# EAGLE design 009 (EAGLE 5.09)
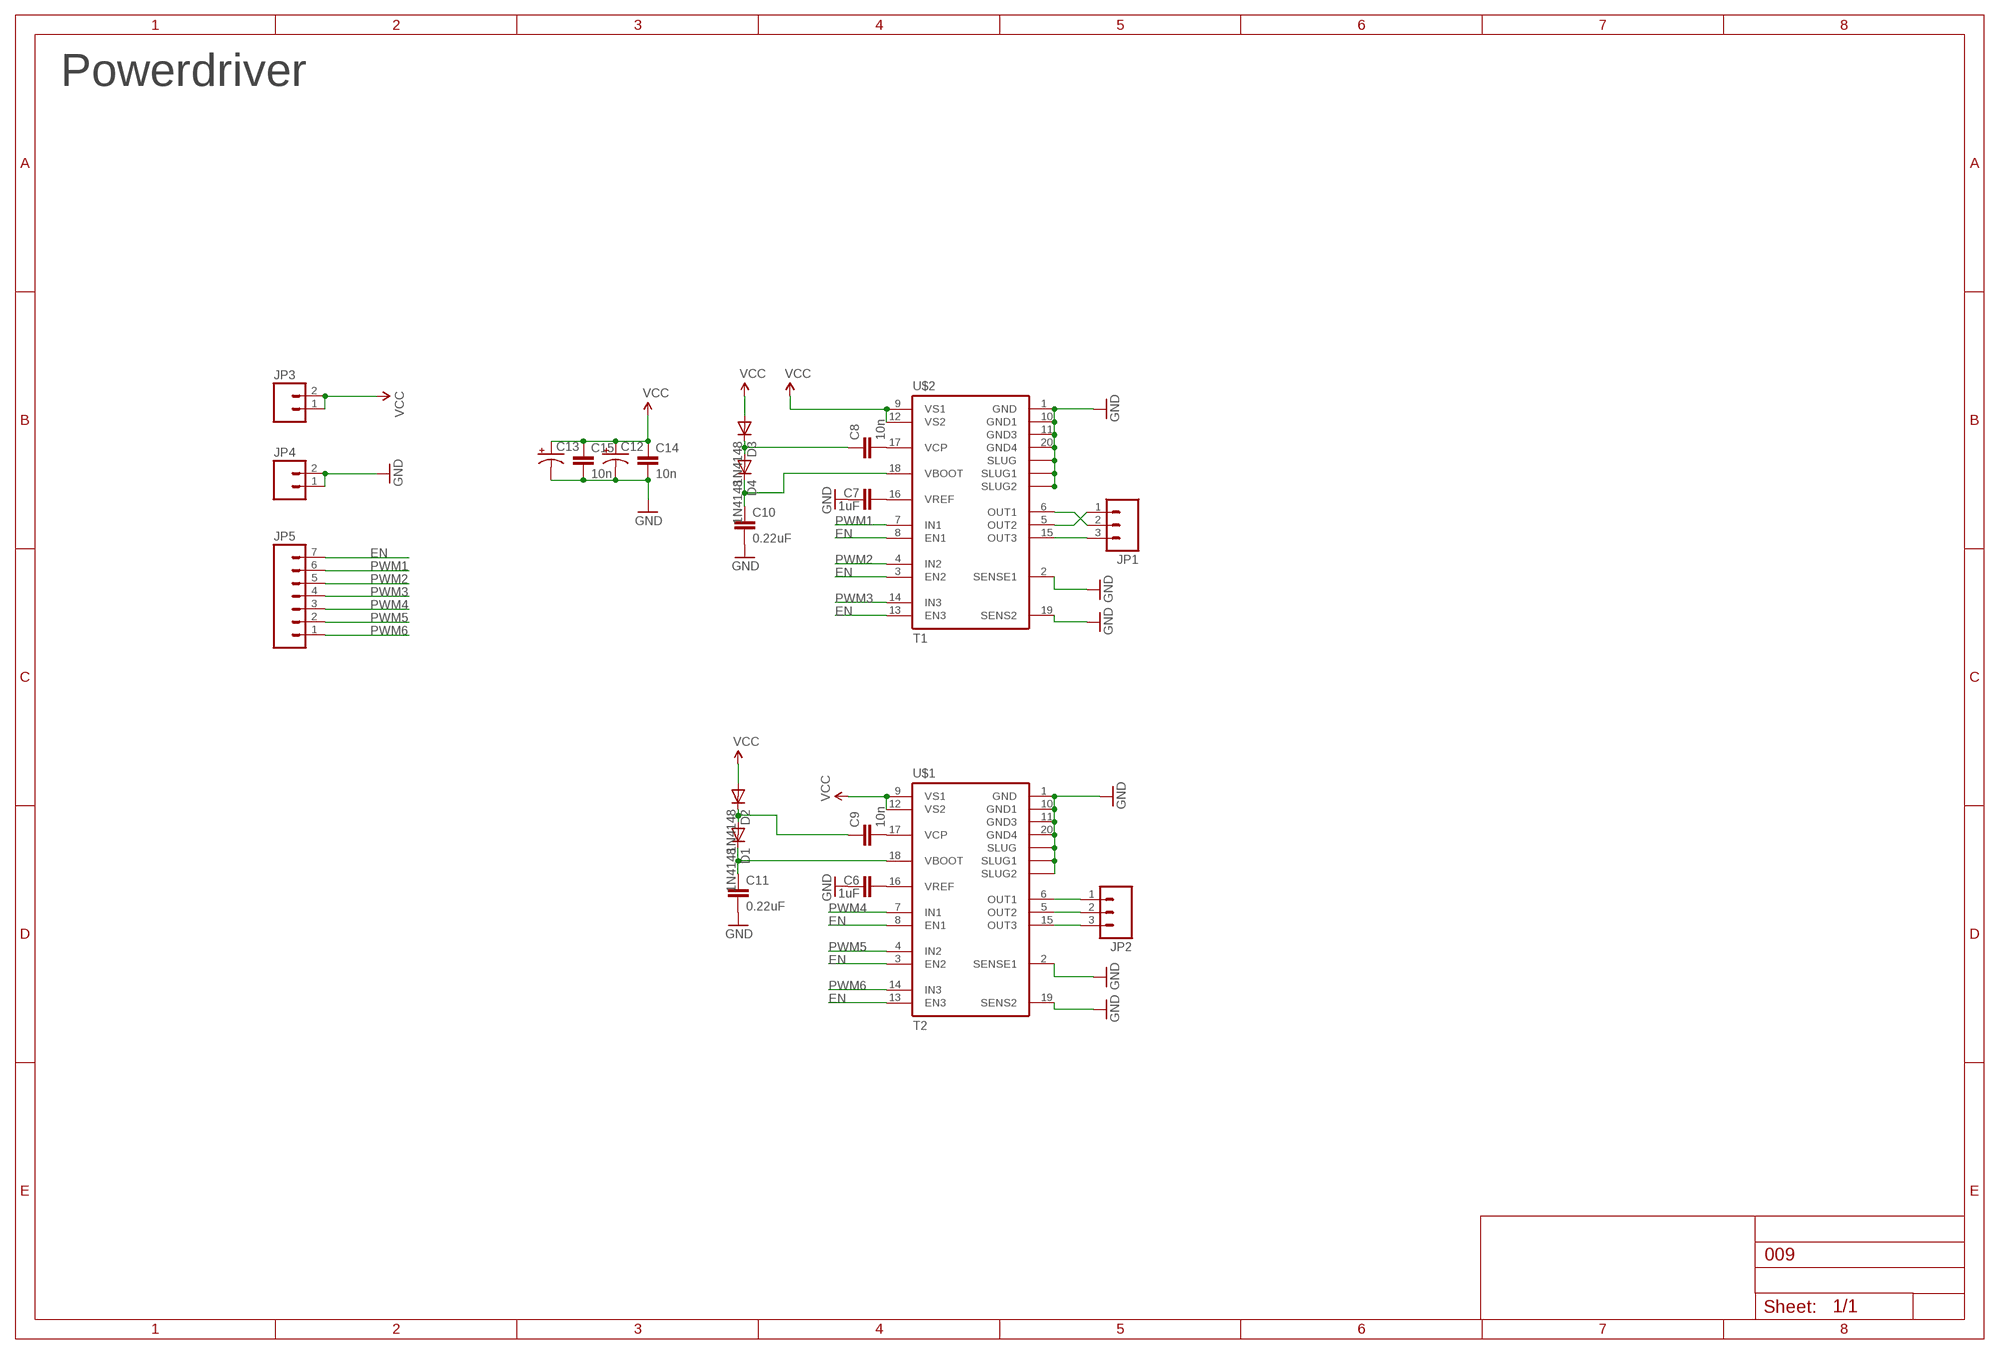
[diagram p0: schematic, sheet 1]

## Parts
C6  1uF  CAP0805  [0805]
C7  1uF  CAP0805  [0805]
C8  10n  CAP0805  [0805]
C9  10n  CAP0805  [0805]
C10  0.22uF  CAP0805  [0805]
C11  0.22uF  CAP0805  [0805]
C12  CAP_POLPTH1  [CPOL-RADIAL-100UF-25V]
C13  CAP_POLPTH1  [CPOL-RADIAL-100UF-25V]
C14  10n  CAP0805  [0805]
C15  10n  CAP0805  [0805]
D1  1N4148  DIODE-MINIMELF  [MINIMELF]
D2  1N4148  DIODE-MINIMELF  [MINIMELF]
D3  1N4148  DIODE-MINIMELF  [MINIMELF]
D4  1N4148  DIODE-MINIMELF  [MINIMELF]
JP1  M03PTH  [1X03]
JP2  M03PTH  [1X03]
JP3  M02PTH  [1X02]
JP4  M02PTH  [1X02]
JP5  M07  [1X07]
U$1  T2  L6234  [SO20POWER2]
U$2  T1  L6234  [SO20POWER2]

## Nets
EN: JP5.7 U$1.3(EN2) U$1.8(EN1) U$1.13(EN3) U$2.3(EN2) U$2.8(EN1) U$2.13(EN3)
GND: C6.1 C7.1 C10.2 C11.2 C12.2(-) C13.2(-) C14.2 C15.2 JP4.1 JP4.2 U$1.1(GND) U$1.2(SENSE1) U$1.10(GND1) U$1.11(GND3) U$1.19(SENS2) U$1.20(GND4) U$1.SLUG1(SLUG2) U$1.SLUG2(SLUG) U$1.SLUG(SLUG1) U$2.1(GND) U$2.2(SENSE1) U$2.10(GND1) U$2.11(GND3) U$2.19(SENS2) U$2.20(GND4) U$2.SLUG1(SLUG2) U$2.SLUG2(SLUG) U$2.SLUG(SLUG1)
N$1: JP1.1 U$2.5(OUT2)
N$2: JP1.2 U$2.6(OUT1)
N$3: JP1.3 U$2.15(OUT3)
N$4: JP2.1 U$1.6(OUT1)
N$5: JP2.2 U$1.5(OUT2)
N$6: JP2.3 U$1.15(OUT3)
N$9: C6.2 U$1.16(VREF)
N$10: C7.2 U$2.16(VREF)
N$11: C8.2 U$2.17(VCP)
N$12: C9.2 U$1.17(VCP)
N$13: C9.1 D1.A D2.C
N$16: C11.1 D1.C U$1.18(VBOOT)
PWM1: JP5.6 U$2.7(IN1)
PWM2: JP5.5 U$2.4(IN2)
PWM3: JP5.4 U$2.14(IN3)
PWM4: JP5.3 U$1.7(IN1)
PWM5: JP5.2 U$1.4(IN2)
PWM6: JP5.1 U$1.14(IN3)
VBOOT: C10.1 D4.C U$2.18(VBOOT)
VCC: C12.1(+) C13.1(+) C14.1 C15.1 D2.A D3.A JP3.1 JP3.2 U$1.9(VS1) U$1.12(VS2) U$2.9(VS1) U$2.12(VS2)
VCP: C8.1 D3.C D4.A

## Notes on the sheet
- FTDI
- Powerdriver

## Library data of the parts
C6-C11 C14 C15 = SparkFun:CAP: Capacitor Standard 0603 ceramic capacitor, and 0.1" leaded capacitor.
C12 C13 = SparkFun:CAP_POL: Capacitor Polarized These are standard SMD and PTH capacitors. Normally 10uF, 47uF, and 100uF in electrolytic and tantalum varieties. Always verify the external diameter of the through hole cap, it varies with capacity, voltage, and manufacturer. The EIA devices should be standard.
D1-D4 = diode:DIODE-: DIODE
JP1 JP2 = SparkFun:M03: Header 3 Standard 3-pin 0.1" header. Use with straight break away headers (SKU : PRT-00116), right angle break away headers (PRT-00553), swiss pins (PRT-00743), machine pins (PRT-00117), and female headers (PRT-00115). Molex polarized connector foot print use with SKU : PRT-08232 with associated crimp pins and housings.
JP3 JP4 = SparkFun:M02: Header 2 Standard 2-pin 0.1" header. Use with straight break away headers (SKU : PRT-00116), right angle break away headers (PRT-00553), swiss pins (PRT-00743), machine pins (PRT-00117), and female headers (PRT-00115). Molex polarized connector foot print use with SKU : PRT-08233 with associated crimp pins and housings.
JP5 = SparkFun:M07: Header 7 Standard 7-pin 0.1" header. Use with straight break away headers (SKU : PRT-00116), right angle break away headers (PRT-00553), swiss pins (PRT-00743), machine pins (PRT-00117), and female headers (PRT-00115). NOTES ON THE VARIANTS LOCK and LOCK_LONGPADS... This footprint was designed to help hold the alignment of a through-hole component (i.e. 7-pin header) while soldering it into place. You may notice that each hole has been shifted either up or down by 0.005 of an inch from it's more standard position (which is usually a perfectly straight line). This slight alteration caused the pins (the squares in the middle) to touch the edges of the holes. Because they are alternating, it causes a "brace" to hold the header in place. 0.005 has proven to be the perfect amount of "off-center" position when using our standard breakaway headers. Although looks a little odd when you look at the bare footprint, once you have a header in there, the alteration is very hard to notice. Also, if you push a header all the way into place, it is covered up entirely on the bottom side. This idea of altering the position of holes to aid alignment will be further integrated into the Sparkfun Library for other footprints. It can help hold any component with 3 or more connection pins.
U$1 U$2 = L6234:L6234

## Net classes
0 default: width 0.152 mm, clearance 0.152 mm

## Board
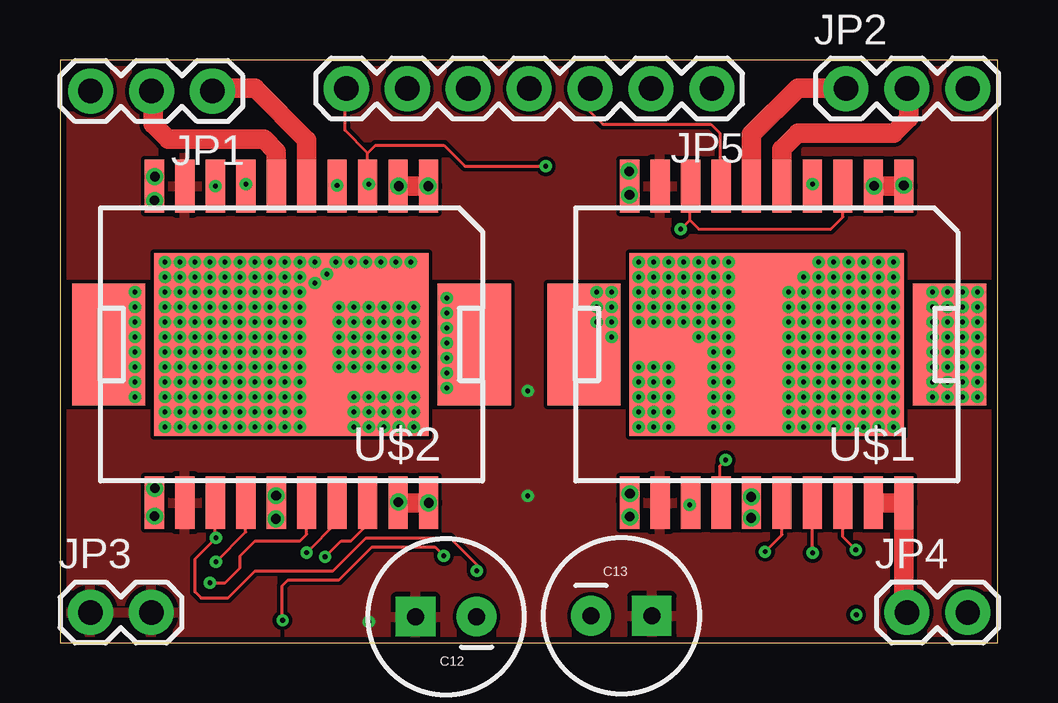
[diagram p1: board, top side]
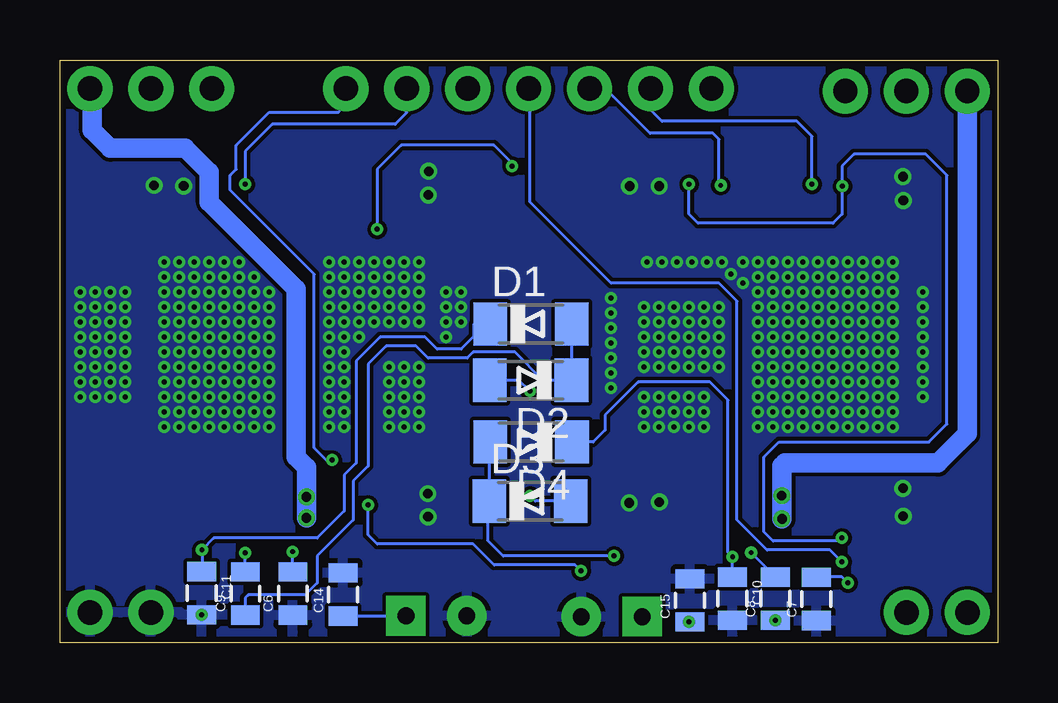
[diagram p2: board, bottom side, seen from below]

Size 39.1 x 24.31 mm. Coordinates in mm from the lower left corner, seen from the top.
Outline: 0,0 39.1,0 39.1,24.31 0,24.31 0,0
Copper layers (1*16): Top 0.035mm / dielectric 1.5mm / Bottom 0.035mm
Design rules "mydefaults": minimum track width 6mil, minimum drill 12mil, track to track 6mil, track to pad 6mil, pad to pad 6mil, via to via 6mil, smd to smd 0mil, copper to edge 10mil, drill to drill 8mil, minimum pad ring 8mil, minimum via ring 6mil, stop-mask expansion 2mil, vias tented up to drill 40mil, thermal gap 8mil

### Footprints (pad centres in the part's own frame; a part is rotated, then mirrored left to right if it is on the bottom)
0805 = smd 0.8 x 1.2: 1 -0.9,0; 2 0.9,0
CPOL-RADIAL-100UF-25V = drill 0.7 pad 1.651 square: 1 1.27,0 | drill 0.7 pad 1.651 round: 2 -1.27,0
MINIMELF = smd 1.4 x 1.8: A 1.7,0; C -1.7,0
1X03 = drill 1.016 pad 1.88 round: 1 0,0; 2 2.54,0; 3 5.08,0
1X02 = drill 1.016 pad 1.88 round: 1 0,0; 2 2.54,0
1X07 = drill 1.016 pad 1.88 round: 1 0,0; 2 2.54,0; 3 5.08,0; 4 7.62,0; 5 10.16,0; 6 12.7,0; 7 15.24,0
SO20POWER2 = smd 0.8 x 2.2: 1 -5.715,-6.6; 2 -4.445,-6.6; 3 -3.175,-6.6; 4 -1.905,-6.6; 5 -0.635,-6.6; 6 0.635,-6.6; 7 1.905,-6.6; 8 3.175,-6.6; 9 4.445,-6.6; 10 5.715,-6.6; 11 5.715,6.6; 12 4.445,6.6; 13 3.175,6.6; 14 1.905,6.6; 15 0.635,6.6; 16 -0.635,6.6; 17 -1.905,6.6; 18 -3.175,6.6; 19 -4.445,6.6; 20 -5.715,6.6 | smd 3.048 x 5.08: SLUG -7.62,0; SLUG2 7.62,0 | smd 11.43 x 7.62: SLUG1 0,0

### Placement (x,y rotation side)
C6  29.39,2.06 90 bottom
C7  7.56,1.83 90 bottom
C8  9.28,1.84 90 bottom
C9  31.37,2.06 90 bottom
C10  11.06,1.85 270 bottom
C11  33.19,2.08 270 bottom
C12  16.09,1.09 180 top
C13  23.4,1.13 0 top
C14  27.29,2.02 90 bottom
C15  12.84,1.78 90 bottom
D1  19.46,13.3 0 bottom
D2  19.47,10.95 180 bottom
D3  19.5,5.92 0 bottom
D4  19.45,8.39 180 bottom
JP1  6.36,23.01 180 top
JP2  32.77,23.11 0 top
JP3  1.27,1.27 0 top
JP4  35.31,1.27 0 top
JP5  27.18,23.11 180 top
U$1  29.46,12.45 180 top
U$2  9.65,12.45 180 top

### Tracks (layer width: path | path; a pad name or v marks a point on that pad's centre or on a via)
EN  (via drill 0.2 pad 0.12)
  Top 0.125: U$2.13 6.48,4.52 v6.5,4.38 5.62,3.5 5.62,2.12 5.88,1.88 7,1.88 8.12,3 11.38,3 12.75,4.38 16.25,4.38 17.38,3.25 v17.38,3 | U$2.8 6.48,19.98 6.5,20 | 12.83,19.62 U$2.3 | 12.83,19.62 12.83,20.42 | 12.83,20.42 11.88,21.38 11.88,23.05 JP5.7 | U$1.3 32.64,17.76 32.12,17.25 26.62,17.25 26.25,17.62 | U$1.8 26.25,19.01 26.25,17.62 | v25.88,17.25 26.25,17.62 | v20.25,19.88 16.88,19.88 16,20.75 13.15,20.75 12.83,20.42 | v12.88,19.12 12.88,19.58 12.83,19.62 | U$1.13 26.29,5.79 v26.25,5.75
  Bottom 0.125: v6.5,4.38 6.5,4.25 9.38,4.25 9.75,4.62 9.75,7.75 9.12,8.38 2.88,8.38 2.12,9.12 2.12,19.5 3,20.38 6,20.38 6.5,19.88 6.5,19.07 U$2.8 6.5,19.02 6.5,17.88 6.88,17.5 12.5,17.5 12.88,17.88 v12.88,19.12 | JP5.7 11.88,23.05 | v26.25,5.75 26.25,4.5 25.88,4.12 21.88,4.12 21,3.25 17.62,3.25 v17.38,3 | v20.25,19.88 20.25,20 21,20.75 24.88,20.75 25.88,19.75 v25.88,17.25
  other vias: 6.48,19.05
GND  (via drill 0.2 pad 0.12, 0.4 pad 0.25)
  Top 0.125: JP4.1 35.19,1.39 | 3.94,5.52 U$2.11 | U$2.20 v15.37,5.84 | v23.76,6.22 U$1.11 | U$2.SLUG 16.18,12.45 v16.12,12.5 | v11.62,14 v10.62,15 | v9.38,12.12 9.38,12.17 U$2.SLUG1 | v3.12,12.12 2.35,12.12 U$2.SLUG2 | v27.88,12.12 29.14,12.12 | 29.14,12.12 U$1.SLUG1 | 29.14,12.12 v31,12.12 | U$1.SLUG 37.08,12.21 v37,12.12 | U$1.10 v23.75,18.69 v23.74,18.68 | U$1.2 v33.93,19.05 v33.94,19.05 | v15.35,19.05 U$2.1 | U$2.10 3.94,19.43 v3.96,19.44 | v22.38,13.38 22.38,12.98 U$1.SLUG2
  Top 0.813: 3.94,5.52 v3.94,5.29 | U$2.19 U$2.20 14.7,5.84 | U$2.2 U$2.1 | U$1.11 23.75,6.25 | U$1.19 U$1.20 35.18,1.4 JP4.1 | U$1.2 U$1.1
  Bottom 0.125: C11.2 33.19,1.06 33.25,1.12
  other vias: 3.94,18.45 3.95,6.45 14.11,5.88 14.12,19.05 23.73,19.67 23.75,5.26 35.18,19.08 3.12,14.62 3.12,10.25 4.38,15.88 14.62,15.88 4.38,9 33.19,1.18 4.38,15.25 4.38,14.62 4.38,14 4.38,13.38 4.38,12.75 4.38,12.12 4.38,11.5 4.38,10.88 4.38,10.25 4.38,9.62 5,15.88 5,9 5,15.25 5,14.62 5,14 5,13.38 5,12.75 5,12.12 5,11.5 5,10.88 5,10.25 5,9.62 5.62,15.88 5.62,9 5.62,15.25 5.62,14.62 5.62,14 5.62,13.38 5.62,12.75 5.62,12.12 5.62,11.5 5.62,10.88 5.62,10.25 5.62,9.62 6.25,15.88 6.25,9 6.25,15.25 6.25,14.62 6.25,14 6.25,13.38 6.25,12.75 6.25,12.12 6.25,11.5 6.25,10.88 6.25,10.25 6.25,9.62 6.88,15.88 6.88,9 6.88,15.25 6.88,14.62 6.88,14 6.88,13.38 6.88,12.75 6.88,12.12 6.88,11.5 6.88,10.88 6.88,10.25 6.88,9.62 7.5,15.88 7.5,9 7.5,15.25 7.5,14.62 7.5,14 7.5,13.38 7.5,12.75 7.5,12.12 7.5,11.5 7.5,10.88 7.5,10.25 7.5,9.62 8.12,15.88 8.12,9 8.12,15.25 8.12,14.62 8.12,14 8.12,13.38 8.12,12.75 8.12,12.12 8.12,11.5 8.12,10.88 8.12,10.25 8.12,9.62 8.75,15.88 8.75,9 8.75,15.25 8.75,14.62 8.75,14 8.75,13.38 8.75,12.75 8.75,12.12 8.75,11.5 8.75,10.88 8.75,10.25 8.75,9.62 9.38,15.88 9.38,9 9.38,15.25 9.38,14.62 9.38,14 9.38,13.38 9.38,12.75 9.38,11.5 9.38,10.88 9.38,10.25 9.38,9.62 10,15.88 10,9 10,15.25 10,14.62 10,14 10,13.38 10,12.75 10,12.12 10,11.5 10,10.88 10,10.25 10,9.62 11.12,15.38 10.62,15.88 11.5,15.88 12.12,15.88 12.75,15.88 13.38,15.88 14,15.88 11.62,13.38 11.62,12.75 11.62,12.12 11.62,11.5 12.25,9 12.25,14 12.25,13.38 12.25,12.75 12.25,12.12 12.25,11.5 12.25,10.25 12.25,9.62 12.88,9 12.88,14 12.88,13.38 12.88,12.75 12.88,12.12 12.88,11.5 12.88,10.25 12.88,9.62 13.5,9 13.5,14 13.5,13.38 13.5,12.75 13.5,12.12 13.5,11.5 13.5,10.25 13.5,9.62 14.12,9 14.12,14 14.12,13.38 14.12,12.75 14.12,12.12 14.12,11.5 14.12,10.25 14.12,9.62 14.75,9 14.75,14 14.75,13.38 14.75,12.75 14.75,12.12 14.75,11.5 14.75,10.25 14.75,9.62 16.12,14.38 16.12,13.75 16.12,13.12 16.12,11.88 16.12,11.25 16.12,10.62 3.12,10.88 3.12,11.5 3.12,12.75 3.12,13.38 3.12,14 24.12,15.88 24.12,9 24.12,15.25 24.12,14.62 24.12,14 24.12,13.38 24.12,11.5 24.12,10.88 24.12,10.25 24.12,9.62 24.75,15.88 24.75,9 24.75,15.25 24.75,14.62 24.75,14 24.75,13.38 24.75,11.5 24.75,10.88 24.75,10.25 24.75,9.62 25.38,15.88 25.38,9 25.38,15.25 25.38,14.62 25.38,14 25.38,13.38 25.38,11.5 25.38,10.88 25.38,10.25 25.38,9.62 26,15.88 26,15.25 26,14.62 26,14 26,13.38 26.62,15.88 26.62,15.25 26.62,14.62 26.62,14 26.62,13.38 26.62,12.75 27.25,15.88 27.25,9 27.25,15.25 27.25,14.62 27.25,14 27.25,13.38 27.25,12.75 27.25,12.12 27.25,11.5 27.25,10.88 27.25,10.25 27.25,9.62 27.88,15.88 27.88,9 27.88,15.25 27.88,14.62 27.88,14 27.88,13.38 27.88,12.75 27.88,11.5 27.88,10.88 27.88,10.25 27.88,9.62 31,9 31,15.25 31,14.62 31,14 31,13.38 31,12.75 31,11.5 31,10.88 31,10.25 31,9.62 31.62,15.88 31.62,9 31.62,15.25 31.62,14.62 31.62,14 31.62,13.38 31.62,12.75 31.62,12.12 31.62,11.5 31.62,10.88 31.62,10.25 31.62,9.62 32.25,15.88 32.25,9 32.25,15.25 32.25,14.62 32.25,14 32.25,13.38 32.25,12.75 32.25,12.12 32.25,11.5 32.25,10.88 32.25,10.25 32.25,9.62 32.88,15.88 32.88,9 32.88,15.25 32.88,14.62 32.88,14 32.88,13.38 32.88,12.75 32.88,12.12 32.88,11.5 32.88,10.88 32.88,10.25 32.88,9.62 33.5,15.88 33.5,9 33.5,15.25 33.5,14.62 33.5,14 33.5,13.38 33.5,12.75 33.5,12.12 33.5,11.5 33.5,10.88 33.5,10.25 33.5,9.62 34.12,15.88 34.12,9 34.12,15.25 34.12,14.62 34.12,14 34.12,13.38 34.12,12.75 34.12,12.12 34.12,11.5 34.12,10.88 34.12,10.25 34.12,9.62 34.75,15.88 34.75,9 34.75,15.25 34.75,14.62 34.75,14 34.75,13.38 34.75,12.75 34.75,12.12 34.75,11.5 34.75,10.88 34.75,10.25 34.75,9.62 22.38,14.62 23,14.62 22.38,14 23,14 23,13.38 23,12.75 36.38,14.62 36.38,14 36.38,13.38 36.38,12.75 36.38,12.12 36.38,11.5 36.38,10.88 36.38,10.25 37,14.62 37,14 37,13.38 37,12.75 37,11.5 37,10.88 37,10.25 37.62,14.62 37.62,14 37.62,13.38 37.62,12.75 37.62,12.12 37.62,11.5 37.62,10.88 37.62,10.25 38.25,14.62 38.25,14 38.25,13.38 38.25,12.75 38.25,12.12 38.25,11.5 38.25,10.88 38.25,10.25 30.38,9 30.38,14.62 30.38,14 30.38,13.38 30.38,12.75 30.38,12.12 30.38,11.5 30.38,10.88 30.38,10.25 30.38,9.62
  pour Bottom: -0.2,24.49 39.29,24.47 39.29,-0.2 -0.21,-0.16
N$1
  Top 0.813: U$2.5 10.29,20.96 8.12,23.12 6.37,23.12 JP1.1
N$2
  Top 0.813: U$2.6 9.02,20.48 8.5,21 4.5,21 3.88,21.62 3.88,23.08 JP1.2
N$3  (via drill 0.4 pad 0.25)
  Top 0.125: 9.02,5.44 U$2.15
  Top 0.254: v9.01,6.14 U$2.15
  Top 0.813: v9,5.17 9.02,5.44
  Bottom 0.813: v9,5.17 9,7.38 8.88,7.5 2.5,7.5 1.27,8.72 JP1.3
N$4
  Top 0.813: U$1.6 28.83,21.2 30.75,23.12 32.76,23.12 JP2.1
N$5
  Top 0.813: U$1.5 30.1,20.6 30.75,21.25 34.75,21.25 35.38,21.88 35.38,23.05 JP2.2
N$6  (via drill 0.4 pad 0.25)
  Top 0.254: U$1.15 28.85,5.83
  Top 0.813: U$1.15 28.83,5.67 v28.82,5.21
  Bottom 0.406: v28.82,6.09 v28.83,6.09 U$1.15 28.82,5.85 28.82,6.38
  Bottom 0.813: v28.82,5.21 v28.82,6.09 28.82,6.38 28.82,7.32 29.25,7.75 29.25,14.75 32.88,18.38 32.88,19.62 33.88,20.62 37,20.62 37.75,21.38 37.75,23.02 JP2.3
N$9  (via drill 0.2 pad 0.12)
  Top 0.125: U$1.16 30.1,4.51 v29.39,3.8
  Bottom 0.125: v29.39,3.8 C6.2
N$10  (via drill 0.2 pad 0.12)
  Top 0.125: U$2.16 10.29,4.54 10,4.25 8.12,4.25 7.5,3.62 7.5,3.12 6.88,2.5 v6.25,2.5
  Bottom 0.125: 7.57,2.74 C7.2 7.54,2.75 6.5,2.75 v6.25,2.5
N$11  (via drill 0.2 pad 0.12)
  Top 0.125: U$2.17 11.56,5.04 v10.28,3.77
  Bottom 0.125: C8.2 9.28,2.76 v10.28,3.77
N$12  (via drill 0.2 pad 0.12)
  Top 0.125: U$1.17 31.37,4.01 v31.38,3.75
  Bottom 0.125: v31.38,3.75 31.38,2.97 C9.2
N$13
  Bottom 0.125: D1.A 17.76,10.97 D2.C 18.95,10.95 20.12,12.12 21.88,12.12 22.12,11.88 23.75,11.88 24.25,12.38 25.5,12.38 26.25,11.62 26.25,7.38 26.88,6.75 26.88,5.12 28.38,3.62 28.38,2.5 28.88,2 31.25,2 31.38,1.88 31.38,1.17 C9.1
N$16  (via drill 0.2 pad 0.12)
  Top 0.125: U$1.18 32.64,4.42 v33.18,3.88
  Bottom 0.125: C11.1 33.18,2.99 v33.18,3.88 32.69,4.38 28.38,4.38 27.25,5.5 27.25,7 26.75,7.5 26.75,11.75 25.75,12.75 23.88,12.75 23.38,12.25 22.38,12.25 21.83,12.8 21.83,13.3 D1.C
PWM1  (via drill 0.2 pad 0.12)
  Top 0.125: v7.75,19.12 U$2.7
  Bottom 0.125: JP5.6 14.48,22.23 14,21.75 8.38,21.75 7.75,21.12 v7.75,19.12
PWM2  (via drill 0.2 pad 0.12)
  Top 0.125: v11.55,19.08 11.5,19.1 U$2.4
  Bottom 0.125: JP5.5 16.36,23.11 14.5,21.25 11.88,21.25 11.62,21 11.62,19.12 v11.55,19.08
PWM3  (via drill 0.2 pad 0.12)
  Top 0.125: U$2.14 7.75,4.62 v6.5,3.38
  Bottom 0.125: v6.5,3.38 7,3.88 9.62,3.88 10.88,5.12 10.88,14.25 11.62,15 16.12,15 19.5,18.38 19.5,23.06 JP5.4
PWM4
  Top 0.125: JP5.3 22.1,22.15 22.62,21.62 27.12,21.62 27.5,21.25 27.5,19.11 U$1.7
PWM5  (via drill 0.2 pad 0.12)
  Top 0.125: v31.38,19.12 U$1.4
  Bottom 0.125: JP5.2 24.64,22.11 25.12,21.62 30.25,21.62 31.38,20.5 v31.38,19.12
PWM6  (via drill 0.2 pad 0.12)
  Top 0.125: v27.75,7.62 27.5,7.38 27.5,5.91 U$1.14
  Bottom 0.125: JP5.1 27.18,22.45 27.5,22.12 30.38,22.12 31.75,20.75 31.75,19.75 32,19.5 32,18.88 28.5,15.38 28.5,8.12 28,7.62 v27.75,7.62
VBOOT  (via drill 0.2 pad 0.12)
  Top 0.125: U$2.18 12.83,4.95 12.12,4.25 11.72,4.25 v11.06,3.58
  Bottom 0.125: C10.1 v11.06,3.58 11.25,3.78 11.25,10.12 12,10.88 15,10.88 16.38,9.5 16.38,8.88 16.88,8.38 17.74,8.38 D4.C
VCC  (via drill 0.2 pad 0.12)
  Bottom 0.125: C14.1 24.68,1.12 C13.1 | D2.A 19.95,10.95 v19.5,10.5 | D3.A 19.29,5.92 v19.5,6.12 | C15.1 v12.87,0.88 v12.88,0.88
  pour Top: -0.2,24.49 39.29,24.47 39.29,-0.2 -0.21,-0.16
VCP  (via drill 0.2 pad 0.12)
  Top 0.125: C8.1 9.25,0.97 9.25,2.38 9.5,2.62 11.62,2.62 13,4 15.62,4 v16,3.62
  Bottom 0.125: C8.1 9.28,0.97 9.25,1 | D3.C 21.12,5.84 | D3.C 21.2,8.34 D4.A | v16,3.62 20.62,3.62 21.25,4.25 21.25,5.86 D3.C
  other vias: 9.28,0.94